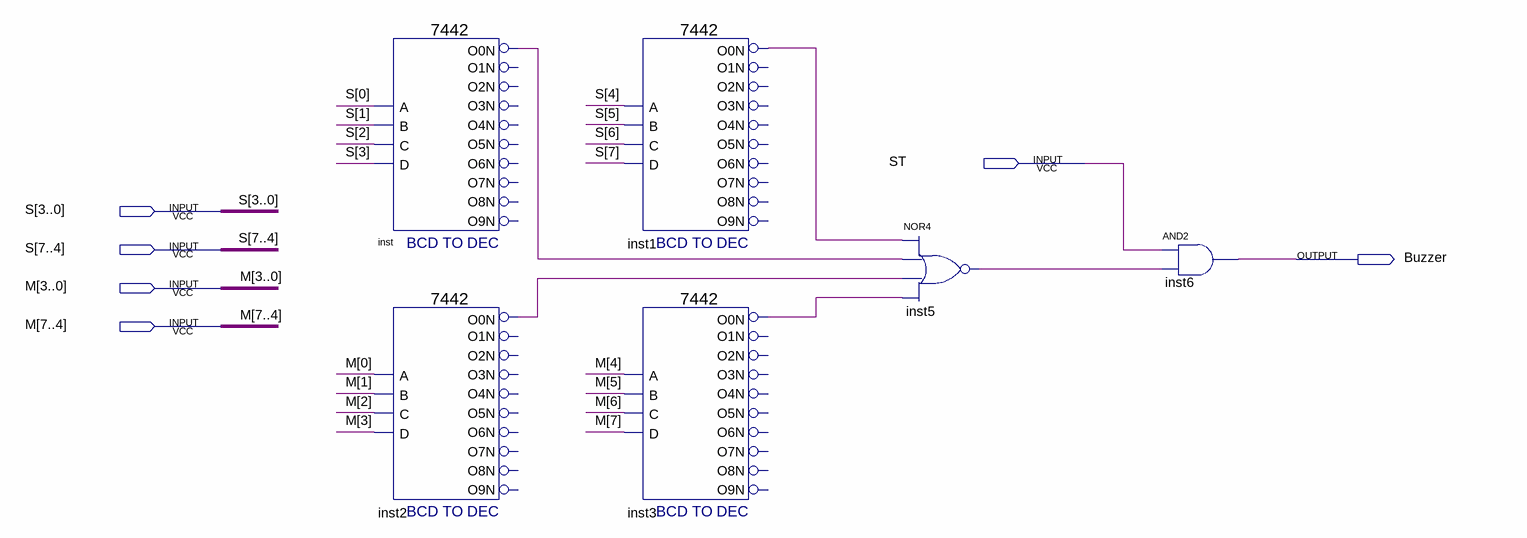
[diagram p0: schematic sheet]
// Quartus schematic Buzzer_Hour.bdf as structural Verilog: 6 symbols, 6 pins
module Buzzer_Hour (
  input  ST,
  input  [7:0] S,
  input  [7:0] M,
  output Buzzer
);

  wire inst1_o0n, inst2_o0n, inst3_o0n, inst5_out, inst_o0n;

  \7442  inst (
    .D(S[3]), .B(S[1]), .C(S[2]), .A(S[0]), .O0N(inst_o0n));  // open: O7N, O8N, O9N, O3N, O2N, O1N, O6N, O5N, O4N
  \7442  inst2 (
    .D(M[3]), .B(M[1]), .C(M[2]), .A(M[0]), .O0N(inst2_o0n));  // open: O7N, O8N, O9N, O3N, O2N, O1N, O6N, O5N, O4N
  \7442  inst1 (
    .D(S[7]), .B(S[5]), .C(S[6]), .A(S[4]), .O0N(inst1_o0n));  // open: O7N, O8N, O9N, O3N, O2N, O1N, O6N, O5N, O4N
  \7442  inst3 (
    .D(M[7]), .B(M[5]), .C(M[6]), .A(M[4]), .O0N(inst3_o0n));  // open: O7N, O8N, O9N, O3N, O2N, O1N, O6N, O5N, O4N
  nor inst5 (inst5_out, inst1_o0n, inst_o0n, inst2_o0n, inst3_o0n);
  and inst6 (Buzzer, ST, inst5_out);
endmodule
